# EAGLE board canSlaveV02_16s (EAGLE 6.3)
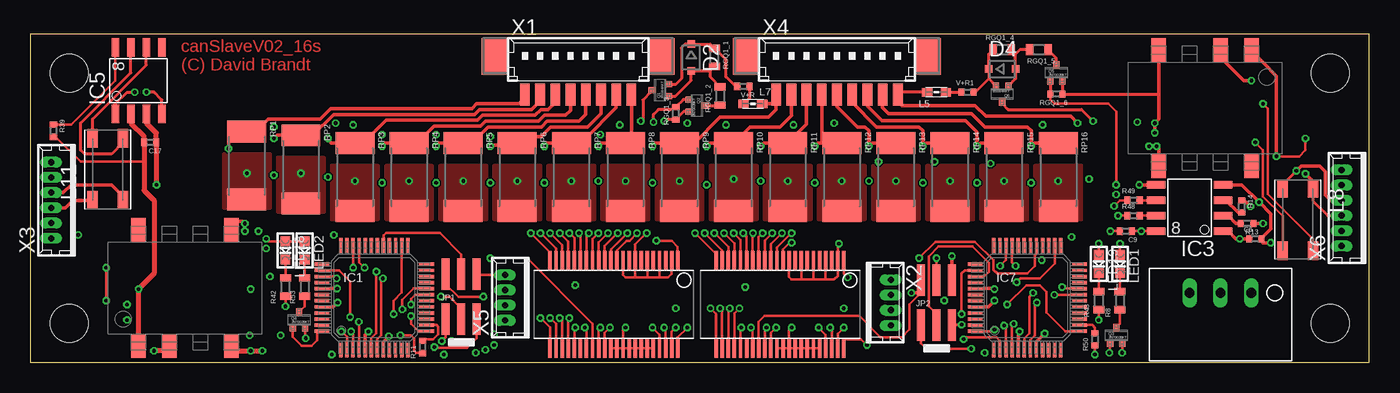
[diagram p6: board, top side]
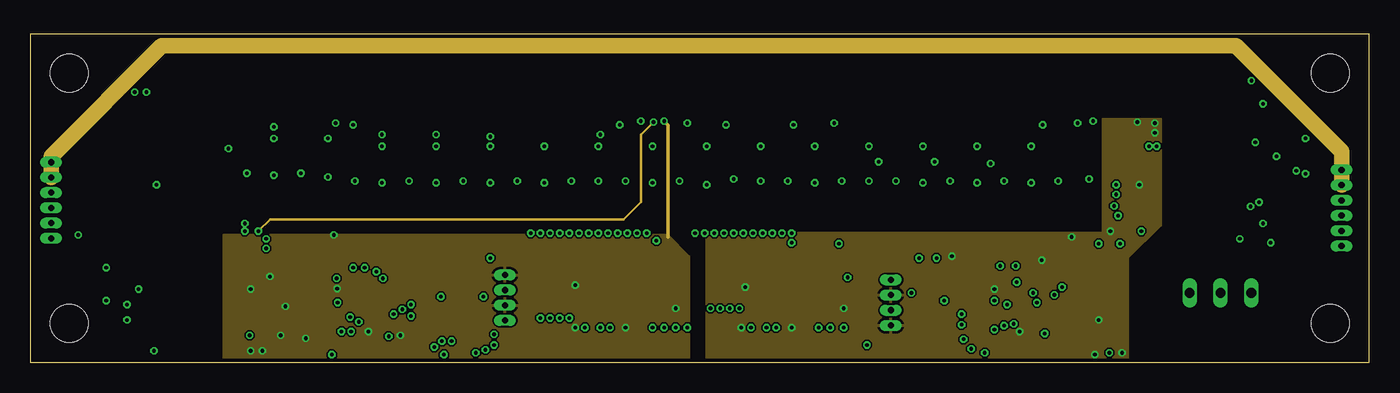
[diagram p7: board, inner layer Route2]
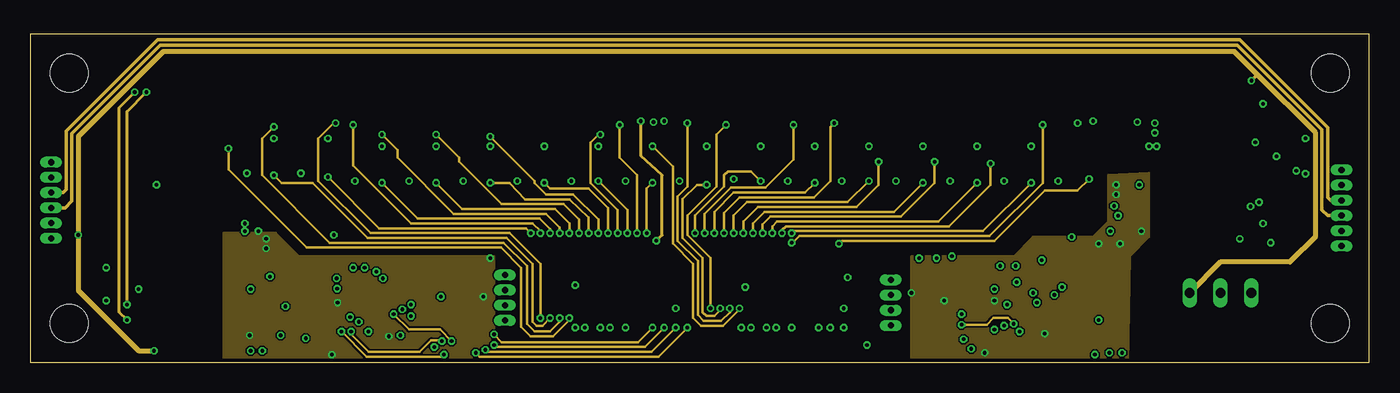
[diagram p8: board, inner layer Route15]
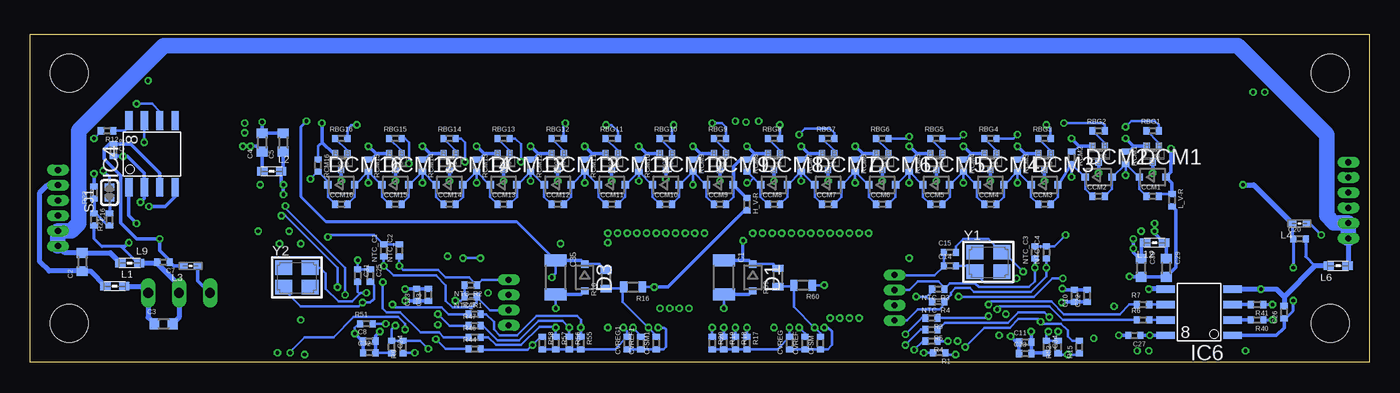
[diagram p9: board, bottom side, seen from below]

Size 110 x 27 mm. Coordinates in mm from the lower left corner, seen from the top.
Outline: 0,0 110,0 110,27 0,27 0,0
Copper layers (1+2*15+16): Top 0.035mm / dielectric 0.38mm / Route2 0.035mm / dielectric 0.71mm / Route15 0.035mm / dielectric 0.38mm / Bottom 0.035mm
Design rules "PCB-POOL Standard_ML4 *": minimum track width 0.15mm, minimum drill 0.3mm, track to track 0.15mm, track to pad 0.15mm, pad to pad 0.15mm, via to via 0.15mm, smd to smd 0.15mm, copper to edge 0.3mm, drill to drill 0.2mm, minimum pad ring 0.2mm, minimum via ring 0.15mm, stop-mask expansion 0.075mm, vias tented up to drill 13mil, thermal gap 0.2mm
Holes 3.1 mm at 3.2,3.2 3.2,23.8 106.8,3.2 106.8,23.8
tRestrict: area 0.2,0.2 to 6.2,6.2; area 0.2,20.8 to 6.2,26.8; area 103.8,0.2 to 109.8,6.2; area 103.8,20.8 to 109.8,26.8
bRestrict: area 0.2,0.2 to 6.2,6.2; area 0.2,20.8 to 6.2,26.8; area 103.8,0.2 to 109.8,6.2; area 103.8,20.8 to 109.8,26.8

## Footprints (pad centres in the part's own frame; a part is rotated, then mirrored left to right if it is on the bottom)
C1206 = smd 1 x 1.8: 1 -1.4,0; 2 1.4,0
C0603 = smd 0.8 x 0.9: 1 -0.75,0; 2 0.75,0
C0402 = smd 0.5 x 0.6: 1 -0.5,0; 2 0.5,0
SOD323-R = smd 0.6 x 0.6: A 1.1,0; C -1.1,0
ISF = smd 1.2 x 2: 1 -3.81,-4.75; 2 -1.27,-4.75; 4 3.81,-4.75; 5 3.81,4.75; 8 -3.81,4.75
TSR1 = drill 0.8 long: 1 -2.54,0; 2 0,0; 3 2.54,0
R0402 = smd 0.5 x 0.6: 1 -0.5,0; 2 0.5,0
LQFP48 = smd 0.28 x 1.2: 1 -2.75,-4.3; 2 -2.25,-4.3; 3 -1.75,-4.3; 4 -1.25,-4.3; 5 -0.75,-4.3; 6 -0.25,-4.3; 7 0.25,-4.3; 8 0.75,-4.3; 9 1.25,-4.3; 10 1.75,-4.3; 11 2.25,-4.3; 12 2.75,-4.3; 25 2.75,4.3; 26 2.25,4.3; 27 1.75,4.3; 28 1.25,4.3; 29 0.75,4.3; 30 0.25,4.3; 31 -0.25,4.3; 32 -0.75,4.3; 33 -1.25,4.3; 34 -1.75,4.3; 35 -2.25,4.3; 36 -2.75,4.3 | smd 1.2 x 0.28: 13 4.3,-2.75; 14 4.3,-2.25; 15 4.3,-1.75; 16 4.3,-1.25; 17 4.3,-0.75; 18 4.3,-0.25; 19 4.3,0.25; 20 4.3,0.75; 21 4.3,1.25; 22 4.3,1.75; 23 4.3,2.25; 24 4.3,2.75; 37 -4.3,2.75; 38 -4.3,2.25; 39 -4.3,1.75; 40 -4.3,1.25; 41 -4.3,0.75; 42 -4.3,0.25; 43 -4.3,-0.25; 44 -4.3,-0.75; 45 -4.3,-1.25; 46 -4.3,-1.75; 47 -4.3,-2.25; 48 -4.3,-2.75
44SSOP = smd 1.6 x 0.28: 1 -3.6,5.25; 2 -3.6,4.75; 3 -3.6,4.25; 4 -3.6,3.75; 5 -3.6,3.25; 6 -3.6,2.75; 7 -3.6,2.25; 8 -3.6,1.75; 9 -3.6,1.25; 10 -3.6,0.75; 11 -3.6,0.25; 12 -3.6,-0.25; 13 -3.6,-0.75; 14 -3.6,-1.25; 15 -3.6,-1.75; 16 -3.6,-2.25; 17 -3.6,-2.75; 18 -3.6,-3.25; 19 -3.6,-3.75; 20 -3.6,-4.25; 21 -3.6,-4.75; 22 -3.6,-5.25; 23 3.6,-5.25; 24 3.6,-4.75; 25 3.6,-4.25; 26 3.6,-3.75; 27 3.6,-3.25; 28 3.6,-2.75; 29 3.6,-2.25; 30 3.6,-1.75; 31 3.6,-1.25; 32 3.6,-0.75; 33 3.6,-0.25; 34 3.6,0.25; 35 3.6,0.75; 36 3.6,1.25; 37 3.6,1.75; 38 3.6,2.25; 39 3.6,2.75; 40 3.6,3.25; 41 3.6,3.75; 42 3.6,4.25; 43 3.6,4.75; 44 3.6,5.25
SO-8 = smd 1.524 x 0.61: 1 -2.743,1.905; 2 -2.743,0.635; 3 -2.743,-0.635; 4 -2.743,-1.905; 5 2.743,-1.905; 6 2.743,-0.635; 7 2.743,0.635; 8 2.743,1.905
2X03_1.27MM_SMT = smd 0.65 x 2.6: 1 -1.27,-1.85; 2 -1.27,1.85; 3 0,-1.85; 4 0,1.85; 5 1.27,-1.85; 6 1.27,1.85
0603 = smd 0.85 x 0.7: 1 -0.775,0; 2 0.775,0
0402 = smd 0.7 x 0.6: 1 -0.6,0; 2 0.6,0
WE-SL1 = smd 1.5 x 0.85: 1 -2.55,-1.25; 3 -2.55,1.25; 4 2.55,1.25; 5 2.55,-1.25
CHIPLED_0603 = smd 0.8 x 0.8: A 0,-0.75; C 0,0.75
SOT416 = smd 0.5 x 0.6: 1 -0.5,-0.65; 2 0.5,-0.65; 3 0,0.65
R0603 = smd 0.6 x 0.9: 1 -0.75,0; 2 0.75,0
R2512 = smd 1.8 x 3.2: 1 -2.8,0; 2 2.8,0
SOLDERJUMPER_REFLOW_NOPASTE_SMALL = smd 0.584 x 0.762: 1 -0.445,0; 2 0.445,0
53398-08 = smd 0.8 x 1.8: 1 4.375,-2.5; 2 3.125,-2.5; 3 1.875,-2.5; 4 0.625,-2.5; 5 -0.625,-2.5; 6 -1.875,-2.5; 7 -3.125,-2.5; 8 -4.375,-2.5 | smd 2.1 x 3: S1 6.875,0.625; S2 -6.875,0.625
53047-04 = drill 0.5 pad 0.698 long: 1 1.875,0.45; 2 0.625,0.45; 3 -0.625,0.45; 4 -1.875,0.45
53047-06 = drill 0.5 pad 0.698 long: 1 3.125,0.45; 2 1.875,0.45; 3 0.625,0.45; 4 -0.625,0.45; 5 -1.875,0.45; 6 -3.125,0.45
53398-09 = smd 0.8 x 1.8: 1 5,-2.5; 2 3.75,-2.5; 3 2.5,-2.5; 4 1.25,-2.5; 5 0,-2.5; 6 -1.25,-2.5; 7 -2.5,-2.5; 8 -3.75,-2.5; 9 -5,-2.5 | smd 2.1 x 3: S1 7.5,0.625; S2 -7.5,0.625
CRYSTAL_3.2X2.5 = smd 1.4 x 1.2: 1 -1.1,-0.8; 2 1.1,0.8; GND1 -1.1,0.8; GND2 1.1,-0.8

## Placement (x,y rotation side)
C1  10u,50V  [C1206]  53.02,6.99 270 bottom
C2  10u,35V  [C0603]  105.73,8.26 90 bottom
C3  10u,35V  [C0603]  99.06,3.17 0 bottom
C4  10u  [C0603]  90.96,18.1 90 bottom
C5  10u  [C0603]  89.22,18.1 90 bottom
C6  100n  [C0402]  100.65,10.16 0 top
C7  1u  [C0402]  99.06,8.26 180 bottom
C8  10n  [C0402]  82.15,1.75 0 bottom
C9  100n  [C0402]  90.01,10.79 180 top
C10  10n  [C0402]  24.21,5.48 90 bottom
C11  10n  [C0402]  28.26,1.67 0 bottom
C13  10n  [C0402]  78.26,5.56 90 bottom
C14  18p  [C0402]  34.45,7.94 0 bottom
C15  18p  [C0402]  34.45,9.05 0 bottom
C16  47n  [C0402]  104.78,11.75 270 bottom
C17  100n  [C0402]  9.84,18.1 180 top
C18  100n  [C0402]  103.19,17.46 270 bottom
C20  1u  [C0402]  5.71,10.16 0 bottom
C22  100n  [C0402]  23.18,5.48 90 bottom
C23  100n  [C0402]  28.26,0.71 0 bottom
C24  100n  [C0402]  80.33,1.27 270 bottom
C25  18p  [C0402]  82.07,7.14 270 bottom
C26  100n  [C0402]  6.99,4.13 90 bottom
C27  100n  [C0402]  19.29,2.22 180 bottom
C29  10u  [C0603]  16.67,7.78 270 bottom
C30  10u  [C0603]  18.73,7.78 270 bottom
C31  18p  [C0402]  83.11,7.14 270 bottom
C32  100n  [C0402]  82.15,0.79 0 bottom
C33  100n  [C0402]  77.31,5.56 90 bottom
C34  100n  [C0402]  26.51,1.27 270 bottom
C35  10u,50V  [C1206]  66.83,6.99 270 bottom
CCM1  100n  [C0402]  17.78,13.65 0 bottom
CCM2  100n  [C0402]  22.23,13.65 0 bottom
CCM3  100n  [C0402]  26.67,13.02 0 bottom
CCM4  100n  [C0402]  31.11,13.02 0 bottom
CCM5  100n  [C0402]  35.56,13.02 0 bottom
CCM6  100n  [C0402]  40.01,13.02 0 bottom
CCM7  100n  [C0402]  44.45,13.02 0 bottom
CCM8  100n  [C0402]  48.9,13.02 0 bottom
CCM9  100n  [C0402]  53.34,13.02 0 bottom
CCM10  100n  [C0402]  57.78,13.02 0 bottom
CCM11  100n  [C0402]  62.23,13.02 0 bottom
CCM12  100n  [C0402]  66.67,13.02 0 bottom
CCM13  100n  [C0402]  71.12,13.02 0 bottom
CCM14  100n  [C0402]  75.56,13.02 0 bottom
CCM15  100n  [C0402]  80.01,13.02 0 bottom
CCM16  100n  [C0402]  84.45,13.02 0 bottom
CFSM  1u  [C0402]  45.09,1.59 90 bottom
CFSM1  1u  [C0402]  58.58,1.59 90 bottom
CVREF  1u  [C0402]  46.35,1.59 90 bottom
CVREF1  1u  [C0402]  59.85,1.59 90 bottom
CVREG  1u  [C0402]  47.62,1.59 90 bottom
CVREG1  1u  [C0402]  60.96,1.59 90 bottom
D1  40V  [SOD323-R]  50.64,6.99 270 bottom
D2  12V  [SOD323-R]  54.29,25.08 270 top
D3  40V  [SOD323-R]  64.45,6.99 270 bottom
D4  12V  [SOD323-R]  79.85,24.13 0 top
DCDC1  TES 1-0510  [ISF]  96.52,20.92 180 top
DCDC2  TES 1-0510  [ISF]  12.7,6.11 0 top
DCIN  TSR 1-2450  [TSR1]  97.79,5.71 180 top
DCM1  7.5  [SOD323-R]  17.78,15.24 0 bottom
DCM2  7.5  [SOD323-R]  22.23,15.24 0 bottom
DCM3  7.5  [SOD323-R]  26.67,14.61 0 bottom
DCM4  7.5  [SOD323-R]  31.11,14.61 0 bottom
DCM5  7.5  [SOD323-R]  35.56,14.61 0 bottom
DCM6  7.5  [SOD323-R]  40.01,14.61 0 bottom
DCM7  7.5  [SOD323-R]  44.45,14.61 0 bottom
DCM8  7.5  [SOD323-R]  48.9,14.61 0 bottom
DCM9  7.5  [SOD323-R]  53.34,14.61 0 bottom
DCM10  7.5  [SOD323-R]  57.78,14.61 0 bottom
DCM11  7.5  [SOD323-R]  62.23,14.61 0 bottom
DCM12  7.5  [SOD323-R]  66.67,14.61 0 bottom
DCM13  7.5  [SOD323-R]  71.12,14.61 0 bottom
DCM14  7.5  [SOD323-R]  75.56,14.61 0 bottom
DCM15  7.5  [SOD323-R]  80.01,14.61 0 bottom
DCM16  7.5  [SOD323-R]  84.45,14.61 0 bottom
H_V-R  100  [R0402]  51.12,13.02 270 bottom
IC1  LPC11C1X  [LQFP48]  28.26,5.32 0 top
IC2  LTC6803-4  [44SSOP]  47.94,4.76 270 top
IC3  ADUM1201  [SO-8]  95.25,12.7 180 top
IC4  MCP2551  [SO-8]  100.01,17.14 90 bottom
IC5  MCP2551  [SO-8]  8.89,23.18 90 top
IC6  ADUM1201  [SO-8]  13.97,4.13 180 bottom
IC7  LPC11C1X  [LQFP48]  81.92,5.32 0 top
IC8  LTC6803-4  [44SSOP]  61.59,4.76 270 top
JP1  [2X03_1.27MM_SMT]  35.4,5.4 0 top
JP2  [2X03_1.27MM_SMT]  74.45,4.92 0 top
L1  WE-CBF_0603  [0603]  103.07,6.27 180 bottom
L2  WE-CBF_0603  [0603]  90.17,15.72 180 bottom
L3  WE-CBF_0402  [0402]  96.84,7.94 0 bottom
L4  WE-CBF_0402  [0402]  5.71,11.43 0 bottom
L5  WE-CBF_0603  [0603]  74.45,22.23 0 top
L6  WE-CBF_0603  [0603]  2.54,7.94 0 bottom
L7  WE-CBF_0603  [0603]  59.37,21.27 180 top
L8  WE-SL1  [WE-SL1]  104.14,11.75 270 top
L9  WE-CBF_0603  [0603]  101.84,8.18 180 bottom
L11  WE-SL1  [WE-SL1]  6.35,15.88 90 top
L12  WE-CBF_0603  [0603]  17.62,9.84 0 bottom
L_V-R  100  [R0402]  16.19,13.34 270 bottom
LED1  [CHIPLED_0603]  89.53,8.1 180 top
LED2  [CHIPLED_0603]  22.54,9.21 180 top
LED18  [CHIPLED_0603]  20.95,9.21 180 top
LED19  [CHIPLED_0603]  87.79,8.1 180 top
NTC_C1  100n  [C0402]  80.96,9.21 90 bottom
NTC_C2  100n  [C0402]  79.69,9.21 90 bottom
NTC_C3  100n  [C0402]  27.46,9.05 90 bottom
NTC_C4  100n  [C0402]  26.51,9.05 90 bottom
NTC_R1  1k  [R0402]  73.82,5.4 180 bottom
NTC_R2  1k  [R0402]  73.82,6.35 180 bottom
NTC_R3  1k  [R0402]  35.4,6.03 180 bottom
NTC_R4  1k  [R0402]  35.4,5 180 bottom
Q1  BSS84AKT  [SOT416]  51.75,22.38 90 top
Q2  2N7002BKT  [SOT416]  54.77,21.11 270 top
Q3  2N7002BKT  [SOT416]  89.22,2.22 0 top
Q4  2N7002BKT  [SOT416]  22.07,3.49 0 top
Q5  2N7002BKT  [SOT416]  84.3,23.81 0 top
Q6  BSS84AKT  [SOT416]  79.85,22.07 180 top
QB1  BSS84AKT  [SOT416]  17.78,17.14 180 bottom
QB2  BSS84AKT  [SOT416]  22.23,17.14 180 bottom
QB3  BSS84AKT  [SOT416]  26.67,16.51 180 bottom
QB4  BSS84AKT  [SOT416]  31.11,16.51 180 bottom
QB5  BSS84AKT  [SOT416]  35.56,16.51 180 bottom
QB6  BSS84AKT  [SOT416]  40.01,16.51 180 bottom
QB7  BSS84AKT  [SOT416]  44.45,16.51 180 bottom
QB8  BSS84AKT  [SOT416]  48.9,16.51 180 bottom
QB9  BSS84AKT  [SOT416]  53.34,16.51 180 bottom
QB10  BSS84AKT  [SOT416]  57.78,16.51 180 bottom
QB11  BSS84AKT  [SOT416]  62.23,16.51 180 bottom
QB12  BSS84AKT  [SOT416]  66.67,16.51 180 bottom
QB13  BSS84AKT  [SOT416]  71.12,16.51 180 bottom
QB14  BSS84AKT  [SOT416]  75.56,16.51 180 bottom
QB15  BSS84AKT  [SOT416]  80.01,16.51 180 bottom
QB16  BSS84AKT  [SOT416]  84.45,16.51 180 bottom
R1  100  [R0402]  35.32,0.79 180 bottom
R3  100  [R0402]  35.96,3.65 180 bottom
R4  100  [R0402]  35.96,1.75 180 bottom
R5  100  [R0402]  35.96,2.7 180 bottom
R6  100  [R0402]  18.57,3.49 0 bottom
R7  100  [R0402]  18.57,4.76 0 bottom
R8  330  [R0603]  89.53,5.08 90 top
R9  10k  [R0402]  79.38,1.27 90 bottom
R10  332k0.1%  [R0603]  62.71,6.83 90 bottom
R11  10k  [R0402]  32.23,1.27 90 top
R12  1.5k  [R0402]  103.7,19.05 180 bottom
R13  100  [R0402]  99.97,11.43 180 top
R14  100  [R0402]  99.54,12.82 270 top
R15  10k  [R0402]  23.81,1.27 90 bottom
R16  20k0.1%  [R0603]  60.48,6.19 180 bottom
R17  1M  [R0402]  51.12,1.59 270 bottom
R18  1M  [R0402]  52.07,1.59 270 bottom
R19  4.7k  [R0402]  53.02,1.59 270 bottom
R20  1M  [R0402]  53.98,1.59 270 bottom
R21  60  [R0402]  103.5,11.75 90 bottom
R22  60  [R0402]  104.78,13.97 90 bottom
R39  1.5k  [R0402]  1.91,19.05 270 top
R40  100  [R0402]  9.21,3.49 180 bottom
R41  100  [R0402]  9.21,4.76 180 bottom
R42  330  [R0603]  20.95,6.19 90 top
R43  330  [R0603]  87.79,5.08 90 top
R44  100  [R0402]  73.5,1.11 0 bottom
R45  100  [R0402]  73.5,3.97 0 bottom
R46  100  [R0402]  73.5,2.06 0 bottom
R47  100  [R0402]  73.5,3.02 0 bottom
R48  100  [R0402]  90.65,12.06 0 top
R49  100  [R0402]  90.65,13.34 0 top
R50  10k  [R0402]  87.47,1.91 90 top
R51  10k  [R0402]  82.39,3.17 0 bottom
R52  10k  [R0402]  25.56,1.27 90 bottom
R53  330  [R0603]  22.54,6.19 90 top
R55  1M  [R0402]  64.77,1.59 270 bottom
R56  1M  [R0402]  65.72,1.59 270 bottom
R57  4.7k  [R0402]  66.83,1.59 270 bottom
R58  1M  [R0402]  67.94,1.59 270 bottom
R59  332k0.1%  [R0603]  48.58,6.99 90 bottom
R60  20k0.1%  [R0603]  46.51,6.35 180 bottom
RBG1  3.3k  [R0402]  17.78,19.05 0 bottom
RBG2  3.3k  [R0402]  22.23,19.05 0 bottom
RBG3  3.3k  [R0402]  26.67,18.41 0 bottom
RBG4  3.3k  [R0402]  31.11,18.41 0 bottom
RBG5  3.3k  [R0402]  35.56,18.41 0 bottom
RBG6  3.3k  [R0402]  40.01,18.41 0 bottom
RBG7  3.3k  [R0402]  44.45,18.41 0 bottom
RBG8  3.3k  [R0402]  48.9,18.41 0 bottom
RBG9  3.3k  [R0402]  53.34,18.41 0 bottom
RBG10  3.3k  [R0402]  57.78,18.41 0 bottom
RBG11  3.3k  [R0402]  62.23,18.41 0 bottom
RBG12  3.3k  [R0402]  66.67,18.41 0 bottom
RBG13  3.3k  [R0402]  71.12,18.41 0 bottom
RBG14  3.3k  [R0402]  75.56,18.41 0 bottom
RBG15  3.3k  [R0402]  80.01,18.41 0 bottom
RBG16  3.3k  [R0402]  84.45,18.41 0 bottom
RCM1  100  [R0402]  20,16.83 270 bottom
RCM2  100  [R0402]  24.45,16.83 270 bottom
RCM3  100  [R0402]  28.89,16.19 270 bottom
RCM4  100  [R0402]  33.34,16.19 270 bottom
RCM5  100  [R0402]  37.78,16.19 270 bottom
RCM6  100  [R0402]  42.23,16.19 270 bottom
RCM7  100  [R0402]  46.67,16.19 270 bottom
RCM8  100  [R0402]  51.12,16.19 270 bottom
RCM9  100  [R0402]  55.56,16.19 270 bottom
RCM10  100  [R0402]  60.01,16.19 270 bottom
RCM11  100  [R0402]  64.45,16.19 270 bottom
RCM12  100  [R0402]  68.9,16.19 270 bottom
RCM13  100  [R0402]  73.34,16.19 270 bottom
RCM14  100  [R0402]  77.79,16.19 270 bottom
RCM15  100  [R0402]  82.23,16.19 270 bottom
RCM16  100  [R0402]  86.36,16.19 270 bottom
RGQ1_1  1M,50V  [R0603]  56.2,25.08 270 top
RGQ1_2  100k,50V  [R0603]  56.67,21.91 90 top
RGQ1_3  1M  [R0402]  53.02,20.48 90 top
RGQ1_4  1M,50V  [R0603]  79.85,25.72 0 top
RGQ1_5  100k,50V  [R0603]  82.87,25.72 180 top
RGQ1_6  1M  [R0402]  84.3,22.07 180 top
RP1  100  [R2512]  17.78,16.19 270 top
RP2  100  [R2512]  22.23,15.88 270 top
RP3  100  [R2512]  26.67,15.24 270 top
RP4  100  [R2512]  31.11,15.24 270 top
RP5  100  [R2512]  35.56,15.24 270 top
RP6  100  [R2512]  40.01,15.24 270 top
RP7  100  [R2512]  44.45,15.24 270 top
RP8  100  [R2512]  48.9,15.24 270 top
RP9  100  [R2512]  53.34,15.24 270 top
RP10  100  [R2512]  57.78,15.24 270 top
RP11  100  [R2512]  62.23,15.24 270 top
RP12  100  [R2512]  66.67,15.24 270 top
RP13  100  [R2512]  71.12,15.24 270 top
RP14  100  [R2512]  75.56,15.24 270 top
RP15  100  [R2512]  80.01,15.24 270 top
RP16  100  [R2512]  84.45,15.24 270 top
SJ1  [SOLDERJUMPER_REFLOW_NOPASTE_SMALL]  103.5,13.97 90 bottom
V+R  100  [R0402]  58.58,22.7 180 top
V+R1  100  [R0402]  76.99,22.23 0 top
X1  53398-08  [53398-08]  45.01,24.53 0 top
X2  53047-04  [53047-04]  70.25,4.92 270 top
X3  53047-06  [53047-06]  2.14,13.34 90 top
X4  53398-09  [53398-09]  66.28,24.53 0 top
X5  53047-04  [53047-04]  39.45,5.32 90 top
X6  53047-06  [53047-06]  108.19,12.7 90 top
Y1  [CRYSTAL_3.2X2.5]  31.27,8.26 0 bottom
Y2  [CRYSTAL_3.2X2.5]  88.11,6.99 0 bottom

## Tracks (layer width: path | path; a pad name or v marks a point on that pad's centre or on a via)
+3V3DCOUT  (via drill 0.3)
  Top 0.305: DCDC1.5 92.71,17.62 v92.55,17.78 v91.92,17.78
  Bottom 0.305: v91.92,17.78 91.4,17.78 C4.1 90.94,17.33 L2.2
+3V3DCOUT1  (via drill 0.3)
  Top 0.305: DCDC2.5 16.51,11.27 16.83,11.59 17.46,11.59 v17.62,11.43 v17.62,10.79
  Bottom 0.305: v17.62,11.43 17.62,10.62 L12.2 16.67,9.66 C29.1
BAL1  (via drill 0.3)
  Top 0.203: IC2.25 43.69,3.46 v43.5,3.65
  Route15 0.203: v43.5,3.65 43.5,3.33 42.7,2.54 41.43,2.54 40.8,3.17 40.8,7.94 38.89,9.84 24.61,9.84 19.05,15.4 19.05,18.41 v20,19.37
  Bottom 0.203: RBG1.2 17.28,19.5 17.62,19.84 19.53,19.84 v20,19.37
BAL2  (via drill 0.3)
  Top 0.203: IC2.23 42.69,2.87 v41.91,3.65
  Route15 0.203: v41.91,3.65 41.91,8.1 39.37,10.64 27.94,10.64 23.65,14.92 23.65,18.41 24.92,19.68 v25.08,19.68
  Bottom 0.203: v25.08,19.68 21.91,19.68 21.73,19.5 RBG2.2
BAL3  (via drill 0.3)
  Top 0.203: IC2.21 43.19,9.35 v41.91,10.64
  Route15 0.203: v41.91,10.64 41.91,10.79 41.27,11.43 31.27,11.43 26.51,16.19 v26.51,19.53
  Bottom 0.203: RBG3.2 26.17,19.18 v26.51,19.53
BAL4  (via drill 0.3)
  Top 0.203: IC2.19 44.19,9.94 v43.5,10.64
  Route15 0.203: v43.5,10.64 43.5,11.11 42.39,12.22 34.77,12.22 30.16,16.83 30.16,17.46 v28.89,18.73
  Bottom 0.203: RBG4.2 29.21,18.41 v28.89,18.73
BAL5  (via drill 0.3)
  Top 0.203: IC2.17 45.19,10.53 v45.09,10.64
  Route15 0.203: v45.09,10.64 45.09,11.75 43.81,13.02 38.73,13.02 35.24,16.51 35.24,16.83 v33.34,18.73
  Bottom 0.203: RBG5.2 33.66,18.41 v33.34,18.73
BAL6  (via drill 0.3)
  Top 0.203: IC2.15 46.19,10.16 v46.67,10.64
  Route15 0.203: v46.67,10.64 46.67,11.75 44.61,13.81 42.39,13.81 41.43,14.76 41.43,14.92 v37.78,18.57
  Bottom 0.203: RBG6.2 37.94,18.41 v37.78,18.57
BAL7  (via drill 0.3)
  Top 0.203: IC2.13 47.19,9.57 v48.26,10.64
  Route15 0.203: v48.26,10.64 48.26,12.54 46.04,14.76 46.04,18.1 46.67,18.73 v46.83,18.73
  Bottom 0.203: RBG7.2 43.95,18.87 44.29,19.21 46.35,19.21 v46.83,18.73
BAL8  (via drill 0.3)
  Top 0.203: IC2.11 48.19,9.22 48.97,10 49.21,10 v49.85,10.64
  Route15 0.203: v49.85,10.64 49.85,15.4 48.42,16.83 v48.42,19.53
  Bottom 0.203: RBG8.2 48.4,19.34 v48.42,19.53
BAL9  (via drill 0.3)
  Top 0.203: IC8.25 57.34,4.32 v57.47,4.45
  Route15 0.203: v57.47,4.45 57.47,4.13 56.75,3.41 55.32,3.41 54.85,3.89 54.85,8.33 53.18,10 53.18,13.65 53.98,14.45 v53.98,19.68
  Bottom 0.203: RBG9.2 52.84,19.34 53.18,19.68 v53.98,19.68
BAL10  (via drill 0.3)
  Top 0.203: IC8.23 56.34,3.98 v55.88,4.45
  Route15 0.203: v55.88,4.45 55.88,8.57 53.98,10.48 53.98,12.06 56.36,14.45 56.36,18.73 v57.15,19.53
  Bottom 0.203: RBG10.2 57.28,19.39 v57.15,19.53
BAL11  (via drill 0.3)
  Top 0.203: IC8.21 56.84,9.2 v55.4,10.64
  Route15 0.203: v55.4,10.64 55.4,12.22 57.55,14.37 60.4,14.37 62.71,16.67 v62.71,19.53
  Bottom 0.203: RBG11.2 61.73,19.03 62.23,19.53 v62.71,19.53
BAL12  (via drill 0.3)
  Top 0.203: IC8.19 57.84,9.78 v56.99,10.64
  Route15 0.203: v56.99,10.64 56.99,12.3 58.26,13.57 64.37,13.57 65.72,14.92 65.72,19.37 v66.04,19.68
  Bottom 0.203: RBG12.2 66.17,19.55 v66.04,19.68
BAL13  (via drill 0.3)
  Top 0.203: IC8.17 58.84,10.37 v58.58,10.64
  Route15 0.203: v58.58,10.64 58.58,11.59 59.77,12.78 67.87,12.78 69.69,14.61 v69.69,16.51
  Bottom 0.203: RBG13.2 70.17,18.41 69.69,17.94 v69.69,16.51
BAL14  (via drill 0.3)
  Top 0.203: IC8.15 59.84,10.31 v60.17,10.64
  Route15 0.203: v60.17,10.64 60.17,11.35 60.8,11.99 71.52,11.99 74.3,14.76 v74.3,16.51
  Bottom 0.203: RBG14.2 74.61,18.41 74.3,18.1 v74.3,16.51
BAL15  (via drill 0.3)
  Top 0.203: IC8.13 60.84,9.73 v61.75,10.64
  Route15 0.203: v61.75,10.64 61.75,10.87 62.07,11.19 75.49,11.19 78.9,14.61 v78.9,16.35
  Bottom 0.203: RBG15.2 79.22,18.41 78.9,18.1 v78.9,16.35
BAL16  (via drill 0.3)
  Top 0.203: IC8.11 61.84,9.3 62.55,10 v62.55,9.84
  Route15 0.203: v62.55,9.84 62.63,9.84 63.18,10.4 78.82,10.4 83.19,14.76 v83.19,19.53
  Bottom 0.203: RBG16.2 83.95,19.23 83.66,19.53 v83.19,19.53
C0  (via drill 0.3)
  Top 0.203: IC2.26 44.19,3.55 v44.29,3.65
  Top 0.305: X1.8 40.63,21.74 40.16,21.27 36.67,21.27 36.27,20.88 24.69,20.88 23.81,20 19.53,20 18.2,18.68 RP1.1 16.33,18.68 16.27,18.73 v16.27,17.58
  Route15 0.203: v44.29,3.65 44.29,3.49 42.94,2.14 41.12,2.14 40.32,2.94 40.32,7.78 38.66,9.45 22.7,9.45 16.27,15.88 v16.27,17.58
  Bottom 0.203: DCM1.A | L_V-R.1 17.1,13.84 CCM1.2
  Bottom 0.305: DCM1.A 16.27,15.64 v16.27,17.58 | L_V-R.1 16.19,14.75 DCM1.A
C1  (via drill 0.3)
  Top 0.305: X1.7 41.88,21.48 41.2,20.8 36.91,20.8 36.51,20.4 24.92,20.4 23.2,18.68 RP2.1 20.26,18.68 v20,18.41
  Bottom 0.203: RCM1.1 19.85,17.33 19.38,17.8
  Bottom 0.305: QB1.2 19.38,17.8 v20,18.41
C1M  (via drill 0.3)
  Top 0.203: IC2.24 43.19,3.16 v42.7,3.65
  Route15 0.203: v42.7,3.65 42.07,3.02 41.59,3.02 41.27,3.33 41.27,8.1 39.13,10.24 27.7,10.24 23.18,14.76 20.64,14.76 v20,15.4
  Bottom 0.203: RCM1.2 21.09,15.24 DCM2.A 21.12,14.25 CCM2.2 | RCM1.2 18.91,15.24 DCM1.C 18.88,14.25 CCM1.1 | v20,15.4 RCM1.2
C2  (via drill 0.3)
  Top 0.305: X1.6 43.13,21.38 42.55,20.8 41.95,20.8 41.47,20.32 37.15,20.32 36.75,19.92 29.21,19.92 27.33,18.04 RP3.1 24.71,18.04 v24.45,18.41
  Bottom 0.203: RCM2.1 24.3,17.33 23.83,17.8
  Bottom 0.305: QB2.2 23.83,17.8 v24.45,18.41
C2M  (via drill 0.3)
  Top 0.203: IC2.22 42.69,9.06 v41.12,10.64
  Route15 0.203: v41.12,10.64 40.72,11.03 28.65,11.03 v24.45,15.24
  Bottom 0.203: RCM2.2 25.54,14.61 DCM3.A 25.57,13.62 CCM3.2 | RCM2.2 23.36,15.24 DCM2.C 23.32,14.25 CCM2.1 | v24.45,15.24 RCM2.2
C3  (via drill 0.3)
  Top 0.305: X1.5 44.38,20.73 43.97,20.32 42.23,20.32 41.75,19.84 37.39,19.84 36.99,19.45 33.18,19.45 31.77,18.04 RP4.1 29.15,18.04 v28.89,17.78
  Bottom 0.203: RCM3.1 28.74,16.69 28.27,17.16
  Bottom 0.305: QB3.2 28.27,17.16 v28.89,17.78
C3M  (via drill 0.3)
  Top 0.203: IC2.20 43.69,9.65 v42.7,10.64
  Route15 0.203: v42.7,10.64 42.7,10.95 41.83,11.83 31.83,11.83 v28.89,14.76
  Bottom 0.203: RCM3.2 29.98,14.61 DCM4.A 30.02,13.62 CCM4.2 | RCM3.2 27.8,14.61 DCM3.C 27.77,13.62 CCM3.1 | v28.89,14.76 RCM3.2
C4  (via drill 0.3)
  Top 0.305: X1.4 45.63,20.39 45.09,19.84 42.47,19.84 41.99,19.37 37.62,19.37 36.3,18.04 RP5.1 33.6,18.04 v33.34,17.78
  Bottom 0.203: RCM4.1 33.19,16.69 32.72,17.16
  Bottom 0.305: QB4.2 32.72,17.16 v33.34,17.78
C4M  (via drill 0.3)
  Top 0.203: IC2.18 44.69,10.23 v44.29,10.64
  Route15 0.203: v44.29,10.64 44.29,11.43 43.1,12.62 35.48,12.62 v33.34,14.76
  Bottom 0.203: RCM4.2 34.42,14.61 DCM5.A 34.46,13.62 CCM5.2 | RCM4.2 32.25,14.61 DCM4.C 32.22,13.62 CCM4.1 | v33.34,14.76 RCM4.2
C5  (via drill 0.3)
  Top 0.305: X1.3 46.88,20.45 45.8,19.37 42.74,19.37 41.95,18.57 40.54,18.57 RP6.1 40.01,17.88 37.88,17.88 v37.78,17.78
  Bottom 0.203: RCM5.1 37.63,16.69 37.16,17.16
  Bottom 0.305: QB5.2 37.16,17.16 v37.78,17.78
C5M  (via drill 0.3)
  Top 0.203: IC2.16 45.69,10.45 v45.88,10.64
  Route15 0.203: v45.88,10.64 45.88,11.91 44.29,13.41 40.64,13.41 39.37,14.76 v37.78,14.76
  Bottom 0.203: RCM5.2 38.87,14.61 DCM6.A 38.91,13.62 CCM6.2 | RCM5.2 36.7,14.61 DCM5.C 36.66,13.62 CCM5.1 | v37.78,14.76 RCM5.2
C6  (via drill 0.3)
  Top 0.305: X1.2 48.13,20.95 45.6,18.41 44.83,18.41 RP7.1 42.49,18.04 v42.23,17.78
  Bottom 0.203: RCM6.1 42.08,16.69 41.61,17.16
  Bottom 0.305: QB6.2 41.61,17.16 v42.23,17.78
C6M  (via drill 0.3)
  Top 0.203: IC2.14 46.69,9.86 v47.47,10.64
  Route15 0.203: v47.47,10.64 47.47,12.7 45.88,14.29 42.7,14.29 v42.23,14.76
  Bottom 0.203: RCM6.2 43.31,14.61 DCM7.A 43.35,13.62 CCM7.2 | RCM6.2 41.14,14.61 DCM6.C 41.1,13.62 CCM6.1 | v42.23,14.76 RCM6.2
C7  (via drill 0.3)
  Top 0.305: X1.1 49.38,18.53 RP8.1 46.93,18.04 v46.67,17.78
  Bottom 0.203: RCM7.1 46.52,16.69 46.05,17.16
  Bottom 0.305: QB7.2 46.05,17.16 v46.67,17.78
C7M  (via drill 0.3)
  Top 0.203: IC2.12 47.69,9.28 v49.05,10.64
  Route15 0.203: v49.05,10.64 49.05,12.54 v46.67,14.92
  Bottom 0.203: RCM7.2 47.76,14.61 DCM8.A 47.8,13.62 CCM8.2 | RCM7.2 45.59,14.61 DCM7.C 45.55,13.62 CCM7.1 | v46.67,14.92 RCM7.2
C8  (via drill 0.3)
  Top 0.203: IC8.26 57.84,4.03 v58.26,4.45
  Top 0.305: v51.12,17.78 51.38,18.04 RP9.1 54.55,18.04 56.67,20.16 60.64,20.16 61.28,20.8 61.28,21.27 | X4.9 61.28,21.27 | L7.1 61.28,21.27
  Route15 0.203: v58.26,4.45 58.26,4.37 56.91,3.02 55.09,3.02 54.45,3.65 54.45,8.1 52.78,9.76 52.78,16.11 v51.12,17.78
  Bottom 0.203: DCM9.A 52.24,13.62 CCM9.2
  Bottom 0.305: QB8.2 50.5,17.16 | 50.5,17.16 v51.12,17.78 | 50.5,17.16 50.97,16.69 RCM8.1 51.65,16.69 52.24,16.1 DCM9.A 51.15,13.52 H_V-R.1
C8M  (via drill 0.3)
  Top 0.203: IC2.2 52.69,7.29 52.39,6.99 51.71,6.99 | IC2.10 48.69,7.19 48.9,6.99 49.69,6.99 | 49.69,6.99 50.72,6.99 | 50.72,6.99 51.71,6.99 | 49.69,6.99 IC2.8 49.69,9.69 v50.64,10.64 | IC2.6 50.69,7.01 50.72,6.99 | IC2.4 51.69,7 51.71,6.99
  Route15 0.203: v50.64,10.64 50.64,14.29 v51.12,14.76
  Bottom 0.203: 50.57,15.15 50.03,14.61 DCM8.C 49.99,13.62 CCM8.1 | 50.57,15.15 RCM8.2 | v51.12,14.76 50.96,14.76 50.57,15.15
C9  (via drill 0.3)
  Top 0.305: v55.56,17.78 55.82,18.04 RP10.1 59.11,19.37 61.59,19.37 62.53,20.3 X4.8
  Bottom 0.203: RCM9.1 55.41,16.69 54.94,17.16
  Bottom 0.305: QB9.2 54.94,17.16 v55.56,17.78
C9M  (via drill 0.3)
  Top 0.203: IC8.24 56.84,4.27 v56.67,4.45
  Route15 0.203: v56.67,4.45 56.67,4.29 56.2,3.81 55.56,3.81 55.24,4.13 55.24,8.57 53.58,10.24 53.58,13.43 54.76,14.61 v55.56,14.61
  Bottom 0.203: RCM9.2 56.65,14.61 DCM10.A 56.69,13.62 CCM10.2 | RCM9.2 54.48,14.61 DCM9.C 54.44,13.62 CCM9.1 | v55.56,14.61 RCM9.2
C10  (via drill 0.3)
  Top 0.305: v60.01,17.78 60.27,18.04 RP11.1 63.78,19.59 X4.7
  Bottom 0.203: RCM10.1 59.85,16.69 59.39,17.16
  Bottom 0.305: QB10.2 59.39,17.16 v60.01,17.78
C10M  (via drill 0.3)
  Top 0.203: IC8.22 56.34,8.9 v54.61,10.64
  Route15 0.203: v54.61,10.64 54.61,12.06 56.99,14.45 56.99,15.4 57.31,15.72 59.21,15.72 v60.01,14.92
  Bottom 0.203: RCM10.2 61.09,14.61 DCM11.A 61.13,13.62 CCM11.2 | RCM10.2 58.92,14.61 DCM10.C 58.88,13.62 CCM10.1 | v60.01,14.92 RCM10.2
C11  (via drill 0.3)
  Top 0.305: RP12.1 65.22,18.04 | 65.22,18.04 64.71,18.04 v64.45,17.78 | X4.6 65.03,18.24 65.22,18.04
  Bottom 0.203: RCM11.1 64.3,16.69 63.83,17.16
  Bottom 0.305: QB11.2 63.83,17.16 v64.45,17.78
C11M  (via drill 0.3)
  Top 0.203: IC8.20 57.34,9.49 v56.2,10.64
  Route15 0.203: v56.2,10.64 56.2,12.38 57.78,13.97 63.66,13.97 v64.45,14.76
  Bottom 0.203: RCM11.2 65.54,14.61 DCM12.A 65.58,13.62 CCM12.2 | RCM11.2 63.37,14.61 DCM11.C 63.33,13.62 CCM11.1 | v64.45,14.76 RCM11.2
C12  (via drill 0.3)
  Top 0.305: RP13.1 69.16,18.04 v68.9,17.78 68.9,19.05 68.58,19.37 67.94,19.37 66.28,21.03 X4.5
  Bottom 0.203: RCM12.1 68.75,16.69 68.28,17.16
  Bottom 0.305: QB12.2 68.28,17.16 v68.9,17.78
C12M  (via drill 0.3)
  Top 0.203: IC8.18 58.34,10.08 v57.78,10.64
  Route15 0.203: v57.78,10.64 57.78,12.06 58.9,13.18 67.15,13.18 v68.9,14.92
  Bottom 0.203: RCM12.2 69.98,14.61 DCM13.A 70.02,13.62 CCM13.2 | RCM12.2 67.81,14.61 DCM12.C 67.78,13.62 CCM12.1 | v68.9,14.92 RCM12.2
C13  (via drill 0.3)
  Top 0.305: RP14.1 73.6,18.04 v73.34,17.78 73.34,19.05 73.03,19.37 69.53,19.37 67.53,21.37 X4.4
  Bottom 0.203: RCM13.1 73.19,16.69 72.72,17.16
  Bottom 0.305: QB13.2 72.72,17.16 v73.34,17.78
C13M  (via drill 0.3)
  Top 0.203: IC8.16 59.34,10.61 v59.37,10.64
  Route15 0.203: v59.37,10.64 59.37,11.43 60.33,12.38 70.96,12.38 v73.34,14.76
  Bottom 0.203: RCM13.2 74.43,14.61 DCM14.A 74.47,13.62 CCM14.2 | RCM13.2 72.25,14.61 DCM13.C 72.22,13.62 CCM13.1 | v73.34,14.76 RCM13.2
C14  (via drill 0.3)
  Top 0.305: RP15.1 78.05,18.04 v77.79,17.78 77.79,18.93 76.83,19.88 69.97,19.88 68.78,21.07 X4.3
  Bottom 0.203: RCM14.1 77.64,16.69 77.17,17.16
  Bottom 0.305: QB14.2 77.17,17.16 v77.79,17.78
C14M  (via drill 0.3)
  Top 0.203: IC8.14 60.34,10.02 v60.96,10.64
  Route15 0.203: v60.96,10.64 60.96,11.19 61.36,11.59 74.61,11.59 v77.79,14.76
  Bottom 0.203: RCM14.2 78.88,14.61 DCM15.A 78.91,13.62 CCM15.2 | RCM14.2 76.7,14.61 DCM14.C 76.67,13.62 CCM14.1 | v77.79,14.76 RCM14.2
C15  (via drill 0.3)
  Top 0.305: RP16.1 82.49,18.04 v82.23,17.78 82.23,19.05 81.92,19.37 78.42,19.37 77.31,20.48 70.48,20.48 70.03,20.94 X4.2
  Bottom 0.203: RCM15.1 82.08,16.69 81.61,17.16
  Bottom 0.305: QB15.2 81.61,17.16 v82.23,17.78
C15M  (via drill 0.3)
  Top 0.203: IC8.12 61.34,9.43 v62.55,10.64
  Route15 0.203: v62.55,10.64 62.71,10.79 78.26,10.79 v82.23,14.76
  Bottom 0.203: RCM15.2 81.14,14.61 DCM15.C 81.11,13.62 CCM15.1 | RCM15.2 83.32,14.61 DCM16.A 83.36,13.62 CCM16.2 | v82.23,14.76 RCM15.2
C16  (via drill 0.3)
  Top 0.254: L5.1 71.48,22.23 X4.1
  Top 0.305: v86.04,19.68 85.49,20.24 78.5,20.24 77.63,21.11 71.6,21.11 71.28,21.43 X4.1
  Bottom 0.203: RCM16.1 86.36,17.78 86.04,18.1
  Bottom 0.305: QB16.2 85.11,17.16 86.04,18.1 v86.04,19.68
C16M  (via drill 0.3)
  Top 0.203: IC8.10 62.34,7.03 62.55,6.83 63.34,6.83 | 65.33,6.83 66.04,6.83 66.34,7.13 IC8.2 66.34,9.67 v66.44,9.76 | 65.33,6.83 64.37,6.83 | 64.37,6.83 63.34,6.83 | IC8.8 63.34,6.83 | IC8.6 64.34,6.85 64.37,6.83 | IC8.4 65.34,6.85 65.33,6.83
  Route15 0.203: v66.44,9.76 66.67,10 79.22,10 83.34,14.13 86.04,14.13 v87,15.08
  Bottom 0.203: CCM16.1 85.56,13.62 DCM16.C 85.56,14.89 RCM16.2 86.38,15.69 v87,15.08
CANH  (via drill 0.3)
  Top 0.254: L8.1 102.89,14.62 v104.02,15.76
  Top 0.305: X6.3 106.85,13.32 106.4,13.77 106.4,15.72 105.97,16.15 104.42,16.15 v104.02,15.76 | L11.1 7.6,13.67 6.67,14.61 3.33,14.61 2.69,13.96 X3.3
  Route15 0.305: X6.3 106.85,13.32 106.6,13.57 106.6,19.33 106.55,19.37 99.38,26.54 10.47,26.54 2.94,19.01 2.94,14.21 2.69,13.96 X3.3
  Bottom 0.254: SJ1.2 103.5,15.24 v104.02,15.76
CANJ
  Bottom 0.254: SJ1.1 R21.2
CANL  (via drill 0.3)
  Top 0.254: L8.3 105.39,13.28 106.59,12.07 X6.4
  Top 0.305: L8.3 105.39,14.9 v104.78,15.52 | L11.3 3.48,13.32 2.87,12.71 X3.4
  Route15 0.305: X6.4 106.59,12.07 106.12,12.54 106.12,19.13 99.18,26.07 10.67,26.07 3.41,18.81 3.41,13.26 2.87,12.71 X3.4
  Bottom 0.305: R22.2 v104.78,15.52
CANRX_U_H  (via drill 0.3)
  Top 0.203: R49.1 89.53,13.34 v89.06,12.86 | IC7.19 v84.15,5.57 v84.14,5.56
  Bottom 0.203: v89.06,12.86 89.06,12.7 84.14,7.78 v84.14,5.56
CANRX_U_L  (via drill 0.3)
  Top 0.203: IC1.19 31.6,5.57 31.27,5.24 v31.27,4.76
  Bottom 0.203: R7.1 19.68,4.76 20.48,3.97 25.08,3.97 26.11,5 31.04,5 v31.27,4.76
CANT
  Bottom 0.254: R22.1 C16.1 104.64,12.25 103.64,11.25 R21.1
CANTX_U_H  (via drill 0.3)
  Top 0.203: R48.1 v89.38,12.06 | IC7.20 84.9,6.07 v84.77,6.19
  Bottom 0.203: v89.38,12.06 89.06,12.06 84.77,7.78 v84.77,6.19
CANTX_U_L  (via drill 0.3)
  Top 0.203: IC1.20 31.47,6.07 30.56,5.16 v30.56,4.37
  Bottom 0.203: R6.1 25.16,3.49 26.27,4.6 30.32,4.6 v30.56,4.37
CAR+5V  (via drill 0.3)
  Top 0.305: DCDC1.2 97.79,25.08 99.69,23.18 v100.33,23.18
  Top 0.406: DCDC2.2 11.43,1.27 11.11,0.95 v10.16,0.95
  Route15 0.305: v100.33,23.18 100.83,23.67
  Route15 0.406: DCIN.3 97.79,8.26 103.5,8.26 105.61,10.36 105.61,18.89 100.83,23.67 98.94,25.56 10.91,25.56 3.93,18.57 v3.93,10.48 3.93,5.91 8.89,0.95 v10.16,0.95
  Bottom 0.254: L4.2 4.88,11.43 v3.93,10.48
  Bottom 0.305: L3.2 96.24,6.7 DCIN.3
CAR+5V_H  (via drill 0.3)
  Top 0.305: C6.1 v99.38,10.16 99.06,10.16 98.42,10.79 IC3.1
  Bottom 0.305: L3.1 98.24,7.94 C7.1 98.56,8.39 99.38,9.21 v99.38,10.16 101.28,10.16 102.59,11.47 102.59,15.36 103.94,16.71 103.94,17.54 103.55,17.94 | 101.76,17.94 101.78,17.96 C18.1 103.52,17.96 103.55,17.94 | 103.55,17.94 101.76,17.94 | 101.76,17.94 99.38,15.56 IC4.3
CAR+5V_LFILT  (via drill 0.3)
  Top 0.254: v6.23,7.78 v6.23,5.08
  Top 0.406: IC5.3 9.53,19.68 10.34,18.87 C17.1 10.34,14.62 v10.36,14.61
  Bottom 0.254: v6.23,7.78 6.21,7.79 C20.1 6.32,10.26 L4.1 | C26.1 6.85,3.63 6.23,4.25 v6.23,5.08
  Bottom 0.305: IC6.1 7.62,2.22 6.99,2.86 C26.1
  Bottom 0.406: v10.36,14.61 9.49,14.61 L4.1
CAR+12V
  Bottom 0.406: L1.1 100.89,6.27 DCIN.1 100.33,3.69 C3.1
CAR+12VIN
  Route2 1.27: X3.2 X3.1 1.69,16.93 10.79,26.04 99.06,26.04 107.74,17.36 X6.1 X6.2
  Bottom 0.406: X6.2 108.61,14.57 109.22,13.97 109.22,8.26 108.47,7.5 C2.1 105.08,7.5 L1.2
CARGND  (via drill 0.3)
  Top 0.203: v104.78,18.41 104.78,17.46 104.26,16.95 v102.39,16.95
  Top 0.305: v101.92,9.84 101.28,9.84 101.15,9.98 C6.2 101.15,10.18 101.92,10.95 101.92,12.22 v100.97,13.18 99.54,14.61 IC3.4 | v102.39,16.95 102.39,23.56 DCDC1.1
  Bottom 0.203: R12.2 104.14,19.05 v104.78,18.41
  Bottom 0.254: L9.1 101.2,8.18 102.55,9.53 104.14,9.53 104.78,10.16 C16.2
  Bottom 0.305: C7.2 99.56,8.12 99.54,8.1 | v100.97,13.18 100.65,13.49 IC4.2 100.65,15.56 102.05,16.96 102.06,16.96 | C18.2 102.06,16.96 | 102.55,9.53 102.23,9.53 v101.92,9.84 | 102.06,16.96 v102.39,16.95
  Bottom 0.406: L9.1 99.62,8.18 99.54,8.1 97.79,6.35 DCIN.2 97.79,3.69 C3.2
CARGNDIN
  Bottom 0.406: X6.6 107.17,9.01 C2.2 103.44,9.01 L9.2 | X3.6 1.69,8.01 L6.2
  Bottom 1.27: X3.6 X3.5 2.89,11.46 3.49,12.06 3.49,18.73 10.79,26.04 99.06,26.04 106.05,19.05 106.05,11.43 106.65,10.82 X6.5 X6.6
CARLGND  (via drill 0.3)
  Top 0.203: R39.2 2.09,18.55 4.13,16.51 9.34,16.51
  Top 0.406: DCDC2.1 v8.89,6.03 10.16,7.3 10.16,13.34 9.34,14.15 9.34,16.51 C17.2 9.34,18.6 8.26,19.68 IC5.2
  Bottom 0.254: C20.2 5.21,8.71 4.45,7.94
  Bottom 0.406: IC6.4 v8.89,6.03 7.62,6.03 6.99,5.4 | 6.99,5.4 C26.2 | L6.1 4.45,7.94 6.99,5.4
CR1  (via drill 0.3)
  Bottom 0.305: QB1.3 v17.78,15.56
  pour Top (no thermals): 15.88,12.7 19.68,12.7 19.68,17.14 15.88,17.14
CR2  (via drill 0.3)
  Bottom 0.305: QB2.3 v22.23,15.56
  pour Top (no thermals): 20.32,12.38 24.13,12.38 24.13,16.83 20.32,16.83
CR3  (via drill 0.3)
  Bottom 0.305: QB3.3 v26.67,14.92
  pour Top (no thermals): 24.77,11.75 28.57,11.75 28.57,16.19 24.77,16.19
CR4  (via drill 0.3)
  Bottom 0.305: QB4.3 v31.11,14.92
  pour Top (no thermals): 29.21,11.75 33.02,11.75 33.02,16.19 29.21,16.19
CR5  (via drill 0.3)
  Bottom 0.305: QB5.3 v35.56,14.92
  pour Top (no thermals): 33.66,11.75 37.47,11.75 37.47,16.19 33.66,16.19
CR6  (via drill 0.3)
  Bottom 0.305: QB6.3 v40.01,14.92
  pour Top (no thermals): 38.1,11.75 41.91,11.75 41.91,16.19 38.1,16.19
CR7  (via drill 0.3)
  Bottom 0.305: QB7.3 v44.45,14.92
  pour Top (no thermals): 42.55,11.75 46.35,11.75 46.35,16.19 42.55,16.19
CR8  (via drill 0.3)
  Bottom 0.305: QB8.3 v48.9,14.92
  pour Top (no thermals): 46.99,11.75 50.8,11.75 50.8,16.19 46.99,16.19
CR9  (via drill 0.3)
  Bottom 0.305: QB9.3 v53.34,14.92
  pour Top (no thermals): 51.44,11.75 55.24,11.75 55.24,16.19 51.44,16.19
CR10  (via drill 0.3)
  Bottom 0.305: QB10.3 v57.78,15.08
  pour Top (no thermals): 55.88,11.75 59.69,11.75 59.69,16.19 55.88,16.19
CR11  (via drill 0.3)
  Bottom 0.305: QB11.3 v62.23,14.92
  pour Top (no thermals): 60.33,11.75 64.14,11.75 64.14,16.19 60.33,16.19
CR12  (via drill 0.3)
  Bottom 0.305: QB12.3 v66.67,14.92
  pour Top (no thermals): 64.77,11.75 68.58,11.75 68.58,16.19 64.77,16.19
CR13  (via drill 0.3)
  Bottom 0.305: QB13.3 v71.12,14.92
  pour Top (no thermals): 69.22,11.75 73.03,11.75 73.03,16.19 69.22,16.19
CR14  (via drill 0.3)
  Bottom 0.305: QB14.3 v75.56,14.92
  pour Top (no thermals): 73.66,11.75 77.47,11.75 77.47,16.19 73.66,16.19
CR15  (via drill 0.3)
  Bottom 0.305: QB15.3 v80.01,14.92
  pour Top (no thermals): 78.11,11.75 81.92,11.75 81.92,16.19 78.11,16.19
CR16  (via drill 0.3)
  Bottom 0.305: QB16.3 v84.45,14.92
  pour Top (no thermals): 82.55,11.75 86.36,11.75 86.36,16.19 82.55,16.19
H+3V3  (via drill 0.3)
  Top 0.203: RGQ1_6.2 83.8,21.61 84.14,21.27 88.58,21.27 89.22,20.64 v89.22,14.61 | IC8.30 59.84,3.33 60.33,3.81 68.1,3.81 69.85,2.06 71.6,2.06 72.23,2.7 72.23,4.76 73.18,5.71 JP2.2 | IC3.8 v91.28,10.79 C9.1 | LED19.A v87.79,9.76 | LED1.A v89.53,9.76
  Top 0.254: Q5.1 RGQ1_6.2
  Top 0.279: IC7.8 82.67,1.7 v83.34,2.38 | IC7.44 78.7,4.57 v79.22,5.08 | 73.18,5.71 v72.39,5.71
  Bottom 0.203: NTC_R2.2 NTC_R1.2 74.64,5.08 v75.09,5.08 | R51.1 83.03,3.17 83.34,2.86 v83.34,2.38 | R9.1 78.45,0.77 v78.42,0.79
  Bottom 0.305: C5.1 89.22,15.89 L2.1 89.39,14.78 v89.22,14.61 v89.22,13.81 | C32.1 82.65,1.69 | C8.1 82.65,1.69 | 82.65,1.69 v83.34,2.38 | C33.1 C13.1 79.19,5.06 v79.22,5.08
  pour Route15: 90.17,-0.16 90.33,8.73 91.92,10.32 91.92,15.56 88.58,15.4 88.58,11.59 87.31,10.32 87.31,10.32 82.39,10.32 80.8,8.73 72.39,8.73 72.39,-0.16
H_!RESET  (via drill 0.3)
  Top 0.203: IC7.3 80.17,2.86 v80.01,3.02 | JP2.1 73.18,1.59 73.66,1.11 v77.31,1.11
  Bottom 0.203: v80.01,3.02 80.33,2.7 C24.1 R9.2 77.97,1.77 v77.31,1.11
H_AD1  (via drill 0.3)
  Top 0.203: IC7.33 80.67,8.23 v80.96,7.94
  Bottom 0.203: X2.2 72.22,4.3 NTC_R1.1 73.32,4.95 73.74,4.52 75.33,4.52 75.88,5.08 75.88,6.35 76.68,7.14 80.17,7.14 v80.96,7.94 NTC_C1.1
H_AD2  (via drill 0.3)
  Top 0.203: IC7.34 80.17,8.41 v79.69,7.94
  Bottom 0.203: X2.4 72.87,6.8 NTC_R2.1 73.95,6.99 75.88,6.99 76.52,7.62 79.38,7.62 v79.69,7.94 NTC_C2.1
H_CANRX
  Top 0.203: IC3.6 R49.2
H_CANTX
  Top 0.203: IC3.7 R48.2
H_CAR_CANRX
  Top 0.305: IC3.3 98.23,13.34 99.24,12.32 R14.2
H_CAR_CANRX_T  (via drill 0.3)
  Top 0.305: R14.1 99.75,13.32 v100.25,12.82
  Bottom 0.305: IC4.4 98.11,13.65 98.94,12.82 v100.25,12.82
H_CAR_CANTX
  Top 0.305: R13.2 99.06,11.43 98.42,12.06 IC3.2
H_CAR_CANTX_T  (via drill 0.3)
  Top 0.305: R13.1 v101.28,11.43
  Bottom 0.305: IC4.1 101.92,12.06 v101.28,11.43
H_CSB  (via drill 0.3)
  Top 0.203: IC8.44 66.84,1.76 66.99,1.91 68.26,1.91 v68.74,1.43
  Bottom 0.203: R58.1 68.08,2.09 v68.74,1.43 69.14,1.03 72.79,1.03 72.87,1.11 R44.2
H_FSM  (via drill 0.3)
  Top 0.203: IC8.29 59.34,2.73 v59.21,2.86
  Bottom 0.203: CFSM1.2 58.58,2.22 v59.21,2.86 61.35,4.99 61.35,6.08 | R10.1 61.35,6.08 | 61.35,6.08 R16.2
H_ISP_CAN
  Top 0.203: IC7.14 87.26,3.07 87.47,2.86 R50.2
H_ISP_ENTER  (via drill 0.3)
  Top 0.203: IC7.4 80.67,3.04 v80.8,3.17 | JP2.5 76.49,3.07 v76.52,3.1
  Route15 0.203: v80.8,3.17 80.33,3.65 79.14,3.65 78.58,3.1 v76.52,3.1
  Bottom 0.203: R51.2 v80.8,3.17
H_LED  (via drill 0.3)
  Top 0.203: Q3.1 88.72,0.85 v88.66,0.79 | IC7.48 79.09,2.57 v79.22,2.7
  Bottom 0.203: v88.66,0.79 88.66,0.87 87.47,2.06 85.09,2.06 83.42,3.73 79.77,3.73 79.22,3.17 v79.22,2.7
H_MISO  (via drill 0.3)
  Top 0.203: IC7.26 84.17,8.12 82.95,6.91 81.36,6.91 v81.04,6.59
  Bottom 0.203: R46.1 76.04,2.06 76.44,2.46 77.95,2.46 79.61,4.13 80.72,4.13 81.04,4.45 v81.04,6.59
H_MOSI  (via drill 0.3)
  Top 0.203: IC7.38 76.78,7.57 76.52,7.3 v76.52,3.97
  Bottom 0.203: R47.1 75.56,3.02 v76.52,3.97
H_SCK  (via drill 0.3)
  Top 0.203: IC8.41 65.34,2.28 v64.77,2.86
  Bottom 0.203: R55.1 v64.77,2.86 64.77,3.49 65.09,3.81 68.42,3.81 70.01,2.22 71.44,2.22 71.91,2.7 71.91,3.33 72.55,3.97 R45.2
H_SCK1  (via drill 0.3)
  Top 0.203: v80.25,4.76 81.84,6.35 82.95,6.35 83.5,5.79 83.5,4.13 85.06,2.57 IC7.13
  Bottom 0.203: R45.1 75.64,3.97 76.2,4.52 80.01,4.52 v80.25,4.76
H_SDI  (via drill 0.3)
  Top 0.203: IC8.42 65.84,2.73 v65.72,2.86
  Bottom 0.203: R56.1 v65.72,2.86 66.28,3.41 68.26,3.41 69.85,1.83 71.6,1.83 72.79,3.02 R47.2
H_SDO  (via drill 0.3)
  Top 0.203: IC8.43 66.34,2.37 v66.83,2.86
  Bottom 0.203: R57.1 v66.83,2.86 66.91,2.94 68.18,2.94 69.69,1.43 71.75,1.43 72.39,2.06 R46.2
H_SSEL  (via drill 0.3)
  Top 0.203: IC7.2 79.67,1.77 79.38,2.06 76.83,2.06 v76.68,1.91
  Bottom 0.203: R44.1 75.88,1.11 v76.68,1.91
H_SWCLK  (via drill 0.3)
  Top 0.203: JP2.4 v74.45,8.57 | v73.03,8.57 74.37,9.92 77.63,9.92 79.14,8.41 79.14,7.62 79.45,7.3 81.92,7.3 82.55,7.94 82.55,8.81 82.67,8.93 IC7.29
  Bottom 0.203: v74.45,8.57 v73.03,8.57
H_SWDIO
  Top 0.203: JP2.3 74.45,3.97 73.82,4.6 73.82,8.73 74.61,9.53 77.39,9.53 78.74,8.18 78.74,7.46 78.35,7.07 IC7.39
H_V+  (via drill 0.3)
  Top 0.203: IC8.1 66.84,7.29 v67.15,6.99
  Top 0.254: Q6.3 79.85,21.27 80.33,20.8 86.36,20.8 v87.31,19.84
  Bottom 0.203: C35.1 66.83,7.3 v67.15,6.99 | D3.C 63.22,8.09 R10.2
  Bottom 0.254: v87.31,19.84 87.79,19.37 87.79,13.65 85.72,11.59 70.04,11.59 C35.1
  Bottom 0.305: C35.1 64.75,8.38 D3.C
H_VREF  (via drill 0.3)
  Top 0.203: IC8.31 60.34,2.68 v60.48,2.86
  Bottom 0.203: CVREF1.2 59.85,2.22 v60.48,2.86
H_VREG  (via drill 0.3)
  Top 0.203: IC8.32 60.84,2.42 v61.28,2.86
  Bottom 0.203: R58.2 R57.2 R56.2 R55.2 61.96,1.09 CVREG1.2 60.96,2.54 v61.28,2.86
HCANHL  (via drill 0.3)
  Top 0.203: L8.5 102.89,12.04 101.28,13.65 101.28,17.46 v100.65,18.1
  Bottom 0.203: IC4.7 v100.65,18.1
HCANLL  (via drill 0.3)
  Top 0.203: L8.4 105.39,10.14 101.68,13.85 101.68,20.88 v101.28,21.27
  Bottom 0.203: IC4.6 99.38,20.64 100.01,21.27 v101.28,21.27
HGND  (via drill 0.3)
  Top 0.203: IC8.27 58.34,2.78 v58.42,2.86 | IC8.33 IC8.34 IC8.35 | IC8.35 62.34,2.65 v62.55,2.86 | IC8.40 IC8.39 IC8.38 IC8.37 IC8.36 IC8.35 | C9.2 v88.74,10.79 | R43.1 v87.79,3.49 | Q3.2 89.72,0.82 v89.69,0.79 | R50.1 v87.47,0.64
  Top 0.254: Q5.2 RGQ1_6.1 92.71,22.07
  Top 0.279: IC7.5 81.17,2.5 v81.28,2.54 | IC7.41 79.18,6.07 v79.22,6.03 | JP2.6 v75.72,8.73
  Top 0.305: DCDC1.4 92.71,22.07 92.71,20 v92.39,19.68 v92.39,18.89 | IC3.5 v91.12,14.61
  Bottom 0.203: v58.42,2.86 57.94,2.86 57.78,2.7 57.78,1.27 57.97,1.09 CFSM1.1 CVREF1.1 CVREG1.1 | C35.2 v66.83,4.45 | R16.1 v58.74,6.19 | NTC_C2.2 NTC_C1.2 80.99,9.71 81.76,10.48 85.41,10.48 v85.57,10.32 | C24.2 81.63,0.77 C32.2 | v83.11,8.41 C31.1 C25.1
  Bottom 0.305: C35.2 64.75,5.58 D3.A | v90.96,19.76 C4.2 C5.2 | H_V-R.2 51.3,12.52 57.63,6.19 v58.74,6.19 | v81.28,2.54 81.65,2.17 C8.2 C32.2 | C33.2 C13.2 79.19,6.06 v79.22,6.03
  pour Route2 (rank 6): 55.56,0 90.17,-0.16 90.17,8.57 92.87,11.27 92.87,20 88.11,20 88.11,10.64 55.56,10.64
L+3V3  (via drill 0.3)
  Top 0.203: v19.37,10.16 19.57,9.96 LED18.A LED2.A | JP1.2 34.13,6.43 35.16,5.4 v37.23,5.4 | IC2.30 46.19,3.18 40.8,8.57 v37.78,8.57
  Top 0.254: v51.2,19.76 51.2,20.4 51.59,20.8 52.7,20.8 52.89,20.98 RGQ1_3.2 53.66,21.61 Q2.1
  Top 0.279: IC1.44 24.89,4.57 v25.24,4.92 | IC1.8 29.01,1.7 v29.45,2.14
  Route2 0.203: v51.2,19.76 50.16,18.73 50.16,13.18 48.74,11.75 19.68,11.75 v18.73,10.79
  Bottom 0.203: R52.1 25.38,0.77 25.24,0.64 v24.77,0.64 23.95,0.64 R15.1 | NTC_R4.2 35.96,5 36.35,5.4 | 36.35,5.4 v37.23,5.4 | NTC_R3.2 35.9,5.85 36.35,5.4
  Bottom 0.279: C11.1 28.97,1.67 v29.45,2.14
  Bottom 0.305: L12.1 18.73,9.51 C30.1 18.85,8.53 19.37,9.05 v19.37,9.37 v19.37,10.16 | C23.1 C11.1 | v25.24,4.92 25.19,4.98 C10.1 C22.1 | C27.1 v18.02,2.22 IC6.8
  pour Route15: 15.88,0.16 38.1,0.16 38.1,8.73 22.07,8.73 20.16,10.64 15.88,10.64
L_!RESET  (via drill 0.3)
  Top 0.203: IC1.3 26.51,2.38 v26.35,2.54 | JP1.1 34.13,2.06 v33.81,1.75
  Route15 0.203: v26.35,2.54 26.35,2.3 27.78,0.87 31.99,0.87 32.94,1.83 33.73,1.83 v33.81,1.75
  Bottom 0.203: R52.2 C34.1 26.51,2.38 v26.35,2.54
L_AD1  (via drill 0.3)
  Top 0.203: IC1.33 27.01,8.23 v27.46,7.78
  Bottom 0.203: NTC_C3.1 v27.46,7.78 27.46,6.67 27.94,6.19 32.07,6.19 32.38,6.51 34.42,6.51 NTC_R3.1 34.9,6.17 35.4,6.67 37.07,6.67 37.78,5.95 38.51,5.95 X5.2
L_AD2  (via drill 0.3)
  Top 0.203: IC1.34 v26.51,7.78
  Bottom 0.203: NTC_C4.1 v26.51,7.78 26.51,7.06 27.78,5.79 32.46,5.79 32.78,6.11 33.97,6.11 34.37,5.71 34.37,5.53 NTC_R4.1 34.9,4.79 35.32,4.37 37.07,4.37 37.99,3.44 X5.4
L_CANRX
  Bottom 0.203: IC6.6 R7.2
L_CANTX
  Bottom 0.203: IC6.7 R6.2
L_CAR_CANRX
  Bottom 0.305: IC6.3 R41.2
L_CAR_CANRX_T  (via drill 0.3)
  Top 0.254: IC5.4 10.79,21.59 10.16,22.23 v9.53,22.23
  Route15 0.254: v7.94,4.76 7.94,20.64 v9.53,22.23
  Bottom 0.254: R41.1 v7.94,4.76
L_CAR_CANTX
  Bottom 0.305: IC6.2 R40.2
L_CAR_CANTX_T  (via drill 0.3)
  Top 0.254: IC5.1 6.99,21.27 7.94,22.23 v8.57,22.23
  Route15 0.254: v7.94,3.49 7.3,4.13 7.3,20.95 v8.57,22.23
  Bottom 0.254: R40.1 v7.94,3.49
L_CSB  (via drill 0.3)
  Top 0.203: IC2.44 53.19,2.08 v53.98,2.86
  Route15 0.203: v36.59,0.79 36.91,0.48 51.59,0.48 v53.98,2.86
  Bottom 0.203: R20.1 v53.98,2.86 | R1.2 v36.59,0.79
L_FSM  (via drill 0.3)
  Top 0.203: IC2.29 45.69,2.83 v45.56,2.86
  Bottom 0.203: CFSM.2 45.09,2.38 v45.56,2.86 47.26,4.56 R60.2 47.38,6.24 R59.1
L_ISP_CAN
  Top 0.203: IC1.14 33.37,3.07 33.5,2.94 33.5,2.3 33.1,1.91 32.36,1.91 R11.2
L_ISP_ENTER  (via drill 0.3)
  Top 0.203: IC1.4 27.01,3.31 v26.99,3.33 | v33.18,1.27 33.26,1.19 35.88,1.19 36.67,1.98 JP1.5
  Bottom 0.203: R15.2 24.39,1.77 24.77,2.14 24.77,2.62 25.32,3.17 26.83,3.17 v26.99,3.33 27.23,3.57 28.81,3.57 29.53,2.86 31.59,2.86 v33.18,1.27
L_LED
  Top 0.203: Q4.1 21.57,2.09 22.3,1.35 23.1,1.35 23.57,1.83 23.57,2.46 23.68,2.57 IC1.48
L_MISO  (via drill 0.3)
  Top 0.203: IC1.26 30.51,5.74 29.84,5.08 v29.84,3.97
  Route15 0.203: v34.61,1.75 33.66,2.7 31.11,2.7 v29.84,3.97
  Bottom 0.203: R4.1 v34.61,1.75
L_MOSI  (via drill 0.3)
  Top 0.203: IC1.38 25.37,7.57 26.27,6.67 v26.27,3.73
  Bottom 0.203: R5.1 35.4,2.7 34.85,3.25 29.69,3.25 28.81,4.13 26.67,4.13 v26.27,3.73
L_SCK  (via drill 0.3)
  Top 0.203: IC2.41 51.69,2.28 v51.12,2.86
  Route15 0.203: v38.1,2.3 38.73,1.67 49.93,1.67 v51.12,2.86
  Bottom 0.203: R17.1 v51.12,2.86 | R3.2 36.75,3.65 v38.1,2.3
L_SCK1  (via drill 0.3)
  Top 0.203: IC1.13 31.88,2.57 31.27,3.17 v31.27,3.81
  Bottom 0.203: R3.1 31.43,3.65 v31.27,3.81
L_SDI  (via drill 0.3)
  Top 0.203: IC2.42 52.19,2.73 v52.07,2.86
  Route15 0.203: v38.1,1.43 38.26,1.27 50.48,1.27 v52.07,2.86
  Bottom 0.203: R18.1 v52.07,2.86 | R5.2 36.83,2.7 v38.1,1.43
L_SDO  (via drill 0.3)
  Top 0.203: IC2.43 52.69,2.53 v53.02,2.86
  Route15 0.203: v37.39,1.03 37.54,0.87 51.04,0.87 v53.02,2.86
  Bottom 0.203: R19.1 v53.02,2.86 | R4.2 36.67,1.75 v37.39,1.03
L_SSEL  (via drill 0.3)
  Top 0.203: IC1.2 26.01,2.09 v25.56,2.54
  Route15 0.203: v25.56,2.54 27.62,0.48 33.81,0.48 v33.97,0.64
  Bottom 0.203: R1.1 34.77,0.79 34.61,0.64 v33.97,0.64
L_SWCLK
  Top 0.203: IC1.29 29.01,10.43 29.21,10.64 33.66,10.64 35.4,8.89 JP1.4
L_SWDIO  (via drill 0.3)
  Top 0.203: IC1.39 25,7.07 v25.16,6.91 | JP1.3 35.4,4.45 34.45,5.4 v33.73,5.4
  Bottom 0.203: v25.16,6.91 26.04,6.91 27.54,5.4 v33.73,5.4
L_V+  (via drill 0.3)
  Top 0.203: IC2.1 53.19,9.51 52.7,10 v51.44,10
  Top 0.254: Q1.3 50.96,22.23 50.32,21.59 50.32,20 v50.16,19.84
  Route15 0.254: v51.44,10 51.91,10.48 51.91,15.4 50.16,16.99 v50.16,19.84
  Bottom 0.203: D1.C 48.93,8.09 R59.2
  Bottom 0.254: 50.94,8.38 52.04,8.38 52.07,8.41 51.44,8.41 v51.44,10
  Bottom 0.305: C1.1 50.94,8.38 D1.C
L_VREF  (via drill 0.3)
  Top 0.203: IC2.31 46.69,2.72 v46.83,2.86
  Bottom 0.203: CVREF.2 46.35,2.38 v46.83,2.86
L_VREG  (via drill 0.3)
  Top 0.203: IC2.32 47.19,2.42 v47.62,2.86
  Bottom 0.203: v47.62,2.86 CVREG.2 48.62,1.09 R17.2 R18.2 R19.2 R20.2
LCANHL
  Top 0.254: L11.5 7.6,18.08 6.67,17.14 4.45,17.14 4.13,17.46 4.13,19.68 8.26,23.81 IC5.7
LCANLL
  Top 0.254: L11.4 5.1,20.02 9.53,24.45 IC5.6
LED1C1
  Top 0.203: R8.2 LED1.C
LED1C2
  Top 0.203: R53.2 LED2.C
LGND  (via drill 0.3)
  Top 0.203: IC2.40 IC2.39 IC2.38 IC2.37 IC2.36 IC2.35 | IC2.35 IC2.34 IC2.33 | IC2.35 48.69,2.74 v48.9,2.86 | IC2.27 44.69,2.78 v44.77,2.86 | X5.1 36.57,7.19 JP1.6 | R42.1 v20.95,4.6 | Q4.2 22.57,2.04 v22.62,1.98 | R11.1 31.69,0.77 31.51,0.95 31.51,1.98 31.27,2.22 v30.4,2.22
  Top 0.254: v52.07,19.84 52.2,19.98 RGQ1_3.1 53.66,20.61 Q2.2
  Top 0.279: IC1.41 v25.2,6.07 | IC1.5 27.51,2.27 v27.78,2.54
  Top 0.406: DCDC2.4 16.51,1.27 16.83,0.95 v18.1,0.95 v19.05,0.95
  Route2 0.305: v52.07,19.84 52.39,19.53 52.39,10.32
  Bottom 0.203: CVREG.1 CVREF.1 CFSM.1 44.47,1.09 44.13,1.43 44.13,2.54 44.45,2.86 v44.77,2.86 | C1.2 v53.02,4.45 | R60.1 v44.77,6.35 | NTC_C3.2 NTC_C4.2 25.85,9.55 v24.92,10.48 | C15.1 C14.1 34.95,7.91 35.72,7.14 38.47,7.14 X5.1
  Bottom 0.279: C11.2 27.76,2.52 v27.78,2.54 | C34.2 27.7,0.77 C23.2
  Bottom 0.305: C1.2 50.94,5.58 D1.A | C23.2 C11.2 | v25.2,6.07 25.11,5.98 C10.2 C22.2 | v19.68,7.06 19.65,7.03 C30.2 C29.2 15.88,7.82 15.88,12.54 16.17,12.84 L_V-R.2 | C27.2 v20.56,2.22
  Bottom 0.406: IC6.5 v18.1,6.03
  pour Route2 (rank 6): 15.88,0 54.13,0 54.13,8.73 52.39,10.48 15.88,10.48
N$1
  Top 0.203: R43.2 LED19.C
N$2
  Top 0.203: LED18.C R42.2
N$3
  Top 0.254: Q2.3 56.63,21.11 RGQ1_2.1
N$4
  Top 0.254: V+R.1 59.08,21.75 L7.2
N$5
  Top 0.254: Q5.3 84.3,25.04 RGQ1_5.1
N$6
  Top 0.254: L5.2 V+R1.1
Q1G
  Top 0.254: 55.85,23.98 D2.A 54.29,23.18 53,21.88 Q1.1 | 55.85,23.98 RGQ1_1.2 | 55.85,23.98 55.85,23.48 RGQ1_2.2
Q1G1
  Top 0.254: 80.95,25.37 D4.A 80.95,23.32 Q6.1 | 80.95,25.37 RGQ1_4.2 | RGQ1_5.2 81.3,25.72 80.95,25.37
Q3_COL
  Top 0.203: R8.1 89.53,3.19 Q3.3
Q3_COL1
  Top 0.203: R53.1 22.54,4.62 Q4.3
QBG1
  Bottom 0.203: QB1.1 17.28,18.05 RBG1.1
QBG2
  Bottom 0.203: QB2.1 21.73,18.05 RBG2.1
QBG3
  Bottom 0.203: QB3.1 26.17,17.41 RBG3.1
QBG4
  Bottom 0.203: QB4.1 30.61,17.41 RBG4.1
QBG5
  Bottom 0.203: QB5.1 35.06,17.41 RBG5.1
QBG6
  Bottom 0.203: QB6.1 39.51,17.41 RBG6.1
QBG7
  Bottom 0.203: QB7.1 43.95,17.41 RBG7.1
QBG8
  Bottom 0.203: QB8.1 48.4,17.41 RBG8.1
QBG9
  Bottom 0.203: QB9.1 52.84,17.41 RBG9.1
QBG10
  Bottom 0.203: QB10.1 57.28,17.41 RBG10.1
QBG11
  Bottom 0.203: QB11.1 61.73,17.41 RBG11.1
QBG12
  Bottom 0.203: QB12.1 66.17,17.41 RBG12.1
QBG13
  Bottom 0.203: QB13.1 70.62,17.41 RBG13.1
QBG14
  Bottom 0.203: QB14.1 75.06,17.41 RBG14.1
QBG15
  Bottom 0.203: QB15.1 79.51,17.41 RBG15.1
QBG16
  Bottom 0.203: QB16.1 83.95,17.41 RBG16.1
RS
  Bottom 0.203: R12.1 102.23,19.05 101.92,19.37 IC4.8
RS1
  Top 0.203: IC5.8 6.99,23.18 3.36,19.55 R39.1
V+S
  Top 0.254: V+R.2 57.94,22.7 57.15,23.5 57.15,24.88 RGQ1_1.1 55.85,26.18 D2.C 53.8,26.18 53.5,25.88 53.5,23.34 53.05,22.88 Q1.2
V+S1
  Top 0.254: RGQ1_4.1 78.75,25.37 D4.C 78.75,23.32 | 78.75,23.32 Q6.2 | V+R1.2 77.66,22.23 78.75,23.32
XTALIN  (via drill 0.3)
  Top 0.203: IC1.6 28.01,1.97 28.42,2.38 v28.42,7.46
  Bottom 0.203: C15.2 33.95,9.55 33.34,10.16 31.28,10.16 Y1.2 30.01,9.05 v28.42,7.46
XTALIN1  (via drill 0.3)
  Top 0.203: IC7.6 81.67,1.97 82.07,2.38 82.07,5.4 v82.39,5.71
  Bottom 0.203: v82.39,5.71 82.87,5.71 82.95,5.64 | 82.95,5.64 83.58,5 84.69,5 85.72,6.03 85.72,7.3 86.2,7.78 Y2.2 | C31.2 83.11,5.79 82.95,5.64
XTALOUT  (via drill 0.3)
  Top 0.203: IC1.7 28.51,1.92 28.81,2.22 28.81,6.75 v28.97,6.91
  Bottom 0.203: C14.2 32.86,7.94 Y1.1 32.37,7.37 31.59,6.59 29.29,6.59 v28.97,6.91
XTALOUT1  (via drill 0.3)
  Top 0.203: IC7.7 82.17,1.84 82.55,2.22 82.55,4.76 v82.71,4.92
  Bottom 0.203: Y2.1 89.21,6.02 87.79,4.6 83.03,4.6 v82.71,4.92 82.07,4.92 81.76,5.24 81.76,6.35 82.07,6.67 C25.2

## Text on the board
Top: canSlaveV02_16s / (C) David Brandt